# EAGLE schematic raspdancer21_1.0 (EAGLE 6.4)
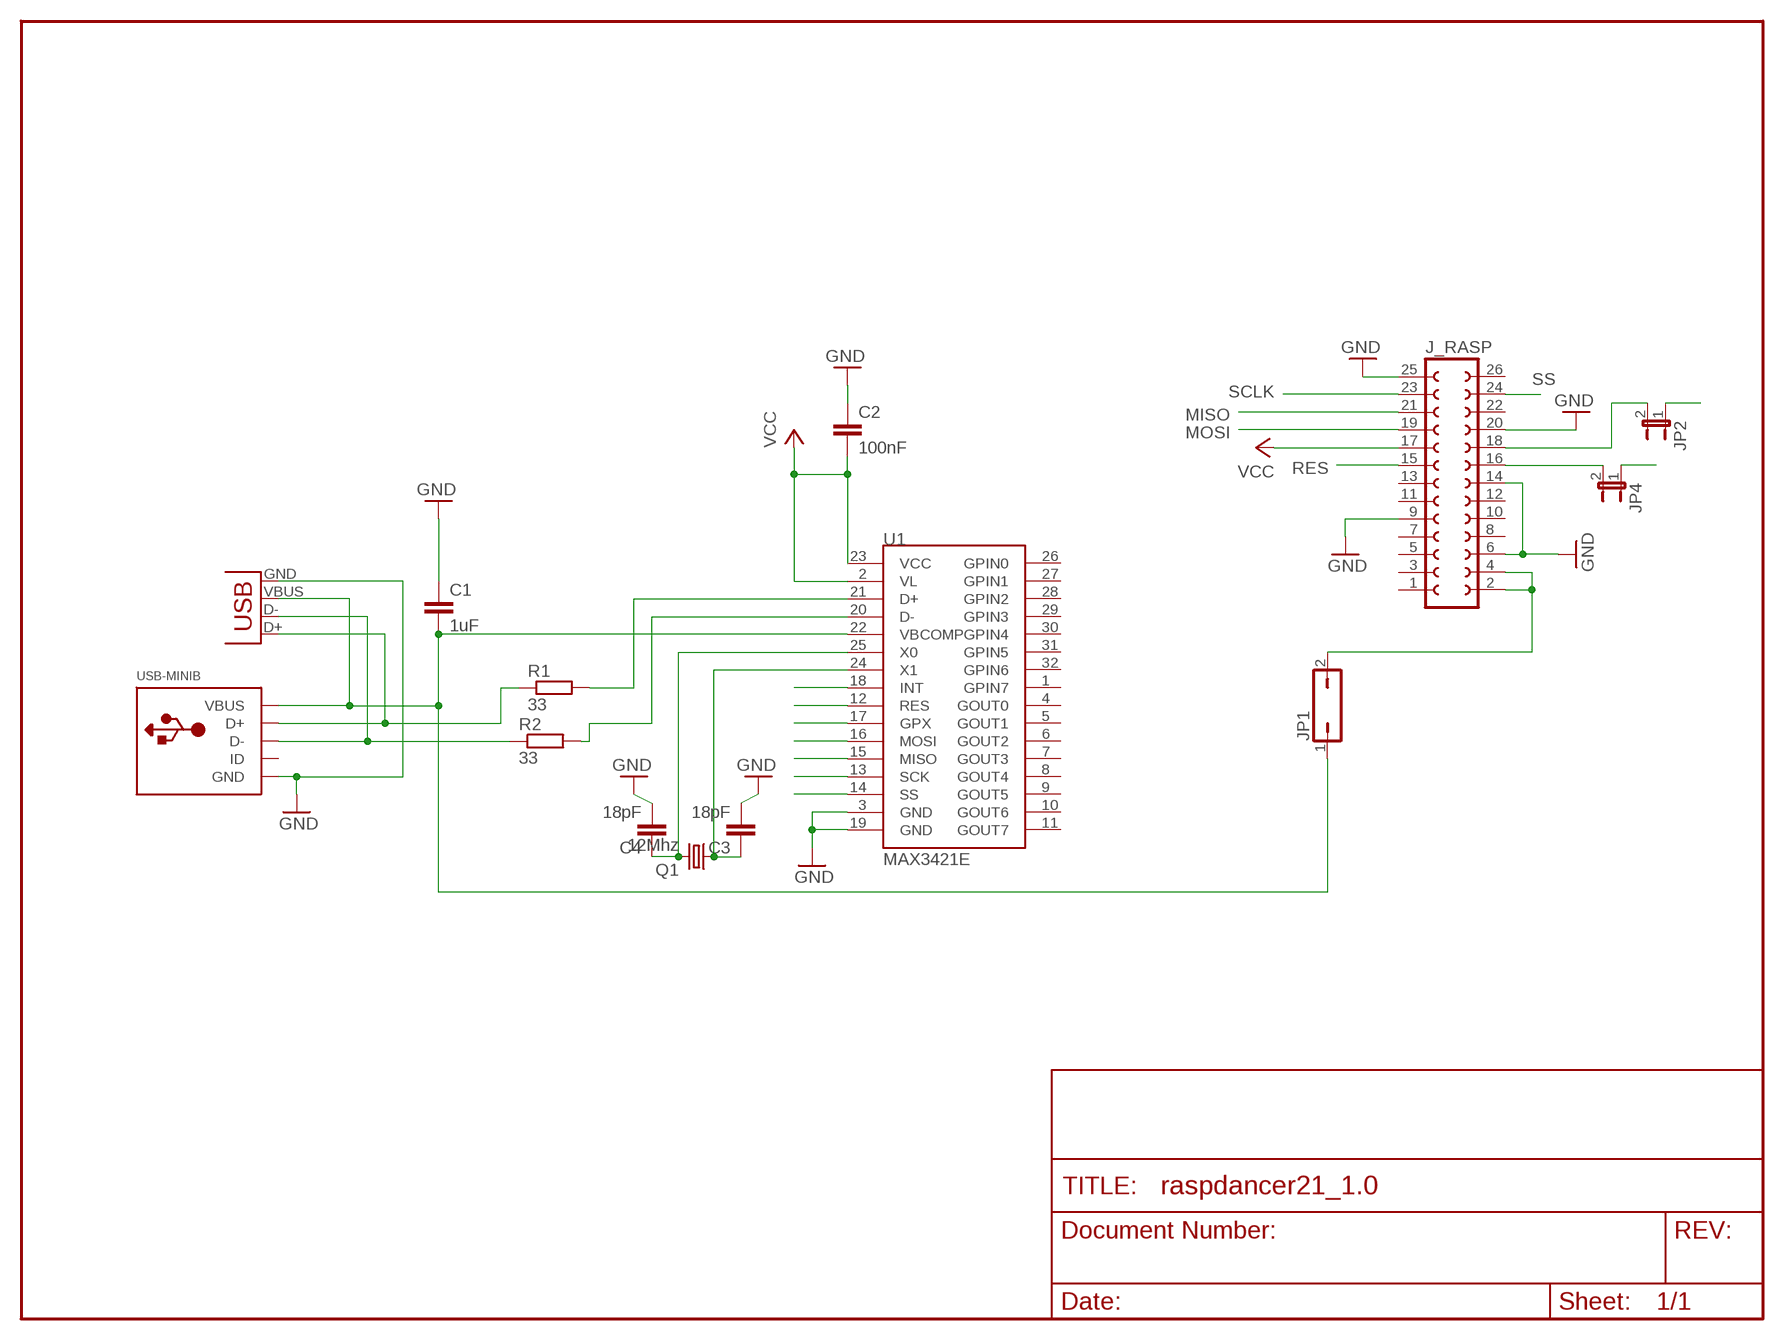
[diagram p0: schematic, sheet 1]

## Parts
C1  1uF  C1206  [C1206]
C2  100nF  C1206  [C1206]
C3  18pF  C1206  [C1206]
C4  18pF  C1206  [C1206]
J_RASP  FE13-2  [FE13-2]
JP1  JP1Q  [JP1]
JP2  JUMPER-2-OLDSMD-NO  [SJ_2S-NO]
JP4  JUMPER-2-OLDSMD-NO  [SJ_2S-NO]
JP5  USB-A-S  [USB-A-S]
Q1  12Mhz  CRYSTALCTS406  [CTS406]
R1  33  R1206  [R1206]
R2  33  R1206  [R1206]
U1  MAX3421E  MAX3421ESMD  [TQFP32-5MM]
USB-MINIB  USBMINIB  [USB-MINIB]

## Nets
D+: R1.2 U1.21(D+)
D+2: JP5.D+ R1.1 USB-MINIB.D+
D-: R2.2 U1.20(D-)
D-2: JP5.D- R2.1 USB-MINIB.D-
GND: C1.1 C2.1 C3.2 C4.2 J_RASP.6 J_RASP.9 J_RASP.14 J_RASP.20 J_RASP.25 JP5.GND U1.3(GND) U1.19(GND) USB-MINIB.GND
GPX: JP4.1 U1.17(GPX)
GPX2: J_RASP.16 JP4.2
INT: JP2.1 U1.18(INT)
INT2: J_RASP.18 JP2.2
IX: C4.1 Q1.3 U1.25(X0)
MISO: J_RASP.21 U1.15(MISO)
MOSI: J_RASP.19 U1.16(MOSI)
RES: J_RASP.15 U1.12(RES)
SCLK: J_RASP.23 U1.13(SCK)
SS: J_RASP.24 U1.14(SS)
VBUS: C1.2 JP1.1 JP5.VBUS U1.22(VBCOMP) USB-MINIB.VBUS
VBUS2: J_RASP.2 J_RASP.4 JP1.2
VCC: C2.2 J_RASP.17 U1.2(VL) U1.23(VCC)
XO: C3.1 Q1.1 U1.24(X1)
Unconnected: J_RASP.1 J_RASP.3 J_RASP.5 J_RASP.7 J_RASP.8 J_RASP.10 J_RASP.11 J_RASP.12 J_RASP.13 J_RASP.22 J_RASP.26 U1.1(GPIN7) U1.4(GOUT0) U1.5(GOUT1) U1.6(GOUT2) U1.7(GOUT3) U1.8(GOUT4) U1.9(GOUT5) U1.10(GOUT6) U1.11(GOUT7) U1.26(GPIN0) U1.27(GPIN1) U1.28(GPIN2) U1.29(GPIN3) U1.30(GPIN4) U1.31(GPIN5) U1.32(GPIN6) USB-MINIB.ID

## Library data of the parts
C1-C4 = 00_mylib:C
J_RASP = doegox:FE13-2: FEMALE HEADER; OC_FARNELL: unknown; OC_NEWARK: unknown
JP1 = jumper:JP1Q: JUMPER
JP2 JP4 = SparkFun:JUMPER-2-OLD: Jumper Basic 0.1" spaced jumper. Use with breakaway headers.
JP5 = SparkFun-Connectors:USB: USB Connectors USB-B-PTH is fully proven SKU : PRT-00139/CONN-08278 USB-miniB is fully proven SKU : PRT-00587 USB-A-PCB is untested. USB-A-H is throughly reviewed, but untested. Spark Fun Electronics SKU : PRT-00437 USB-B-SMT is throughly reviewed, but untested. Needs silkscreen touching up. USB-A-S has not been used/tested USB-MB-H has not been used/tested USB-MICROB has been used. CONN-09505
Q1 = crystal:CRYSTAL: CRYSTAL; OC_FARNELL: unknown; OC_NEWARK: unknown
R1 R2 = 00_mylib:R: Resistance
U1 = SparkFun-DigitalIC:MAX3421E: USB Peripheral/Host Controller w/ SPI
USB-MINIB = adafruit:USB: USB Connectors USBMINIB - Surface Mount Female Mini-B USB Connector 4UConnector: 06564 By microbuilder.eu Thru-hole RA Female Mini-B USB Connector 4UConnector: 18732 By ladyada.net